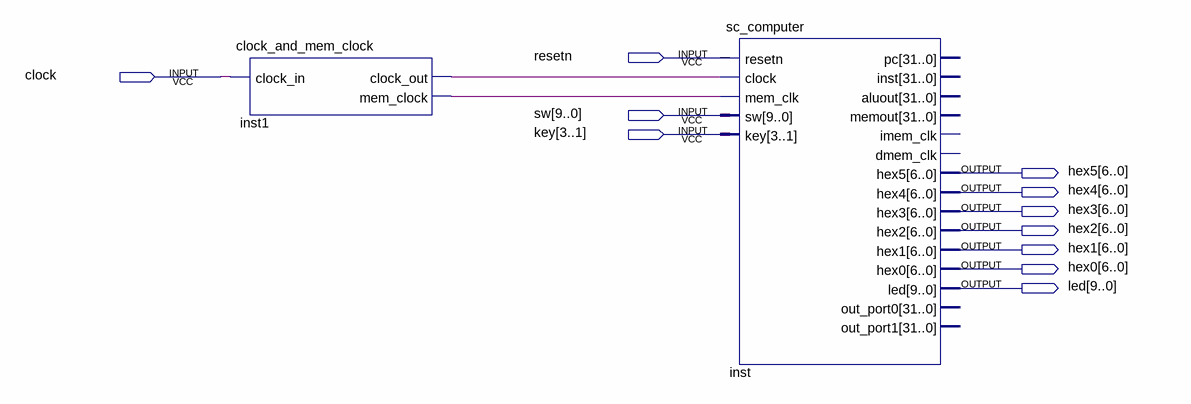
[diagram p0: schematic sheet]
// Quartus schematic calcutator.bdf as structural Verilog: 2 symbols, 11 pins
module calcutator (
  input  resetn,
  input  clock,
  input  [9:0] sw,
  input  [3:1] key,
  output [6:0] hex5,
  output [6:0] hex4,
  output [6:0] hex3,
  output [6:0] hex2,
  output [6:0] hex1,
  output [6:0] hex0,
  output [9:0] led
);

  wire inst1_clock_out, inst1_mem_clock;

  clock_and_mem_clock inst1 (.clock_in(clock), .clock_out(inst1_clock_out), .mem_clock(inst1_mem_clock));
  sc_computer inst (
    .resetn(resetn), .clock(inst1_clock_out), .mem_clk(inst1_mem_clock), .sw(sw), .key(key), .hex5(hex5),
    .hex4(hex4), .hex3(hex3), .hex2(hex2), .hex1(hex1), .hex0(hex0), .led(led));  // open: pc, inst, aluout, memout, imem_clk, dmem_clk, out_port0, out_port1
endmodule
